# Altium schematic sheet Sheet.SchDoc
size A4; SheetNumber: 1; SheetTotal: 1
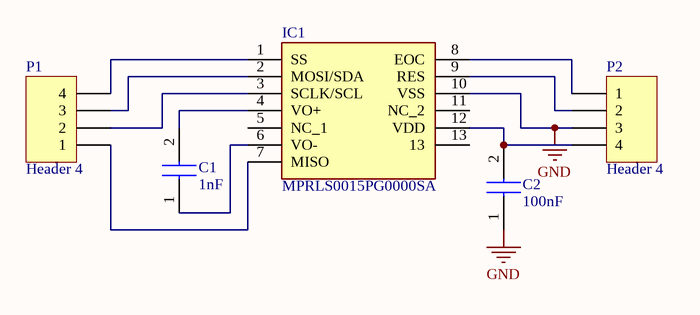
[diagram p0: Sheet.SchDoc]

## Parts
C1  1nF  [CAPC2012X94N]
C2  100nF  [CAPC2012X94N]
IC1  MPRLS0015PG0000SA  [MPRLS0015PG0000SA]
P1  Header 4  [HDR1X4]
P2  Header 4  [HDR1X4]

## Nets
GND: C2.1 IC1.10(VSS) P2.3
NetC1_1: C1.1 IC1.6(VO-)
NetC1_2: C1.2 IC1.4(VO+)
NetC2_2: C2.2 IC1.12(VDD) P2.4
NetIC1_1: IC1.1(SS) P1.4
NetIC1_2: IC1.2(MOSI/SDA) P1.3
NetIC1_3: IC1.3(SCLK/SCL) P1.2
NetIC1_7: IC1.7(MISO) P1.1
NetIC1_8: IC1.8(EOC) P2.1
NetIC1_9: IC1.9(RES) P2.2

Not connected (* = marked no-connect by the designer): IC1 5(NC_1) 11(NC_2) 13

## Library data of the parts
C1 C2 = 08055A130JAT2A: Capacitor; Manufacturer_Name: AVX; Datasheet Link: https://componentsearchengine.com/Datasheets/1/06031A100FAT2A.pdf; Height: 0.94mm; Manufacturer_Part_Number: 08055A130JAT2A; Mouser Part Number: 581-08055A130JAT2A; Mouser Price/Stock: https://www.mouser.com/Search/Refine.aspx?Keyword=581-08055A130JAT2A
IC1 = MPRLS0015PG0000SA: Integrated Circuit; Manufacturer_Name: Honeywell Sensing and Productivity Solutions; Datasheet Link: https://sensing.honeywell.com/honeywell-sensing-micropressure-board-mount-pressure-mpr-series-datasheet-32332628.pdf; Height: 5.8mm; Manufacturer_Part_Number: MPRLS0015PG0000SA
P1 P2 = Header 4: Header, 4-Pin; LatestRevisionDate: 17-Jul-2002; LatestRevisionNote: Re-released for DXP Platform.; Publisher: Altium Limited